# Altium schematic sheet Sheet1.SchDoc
size A3
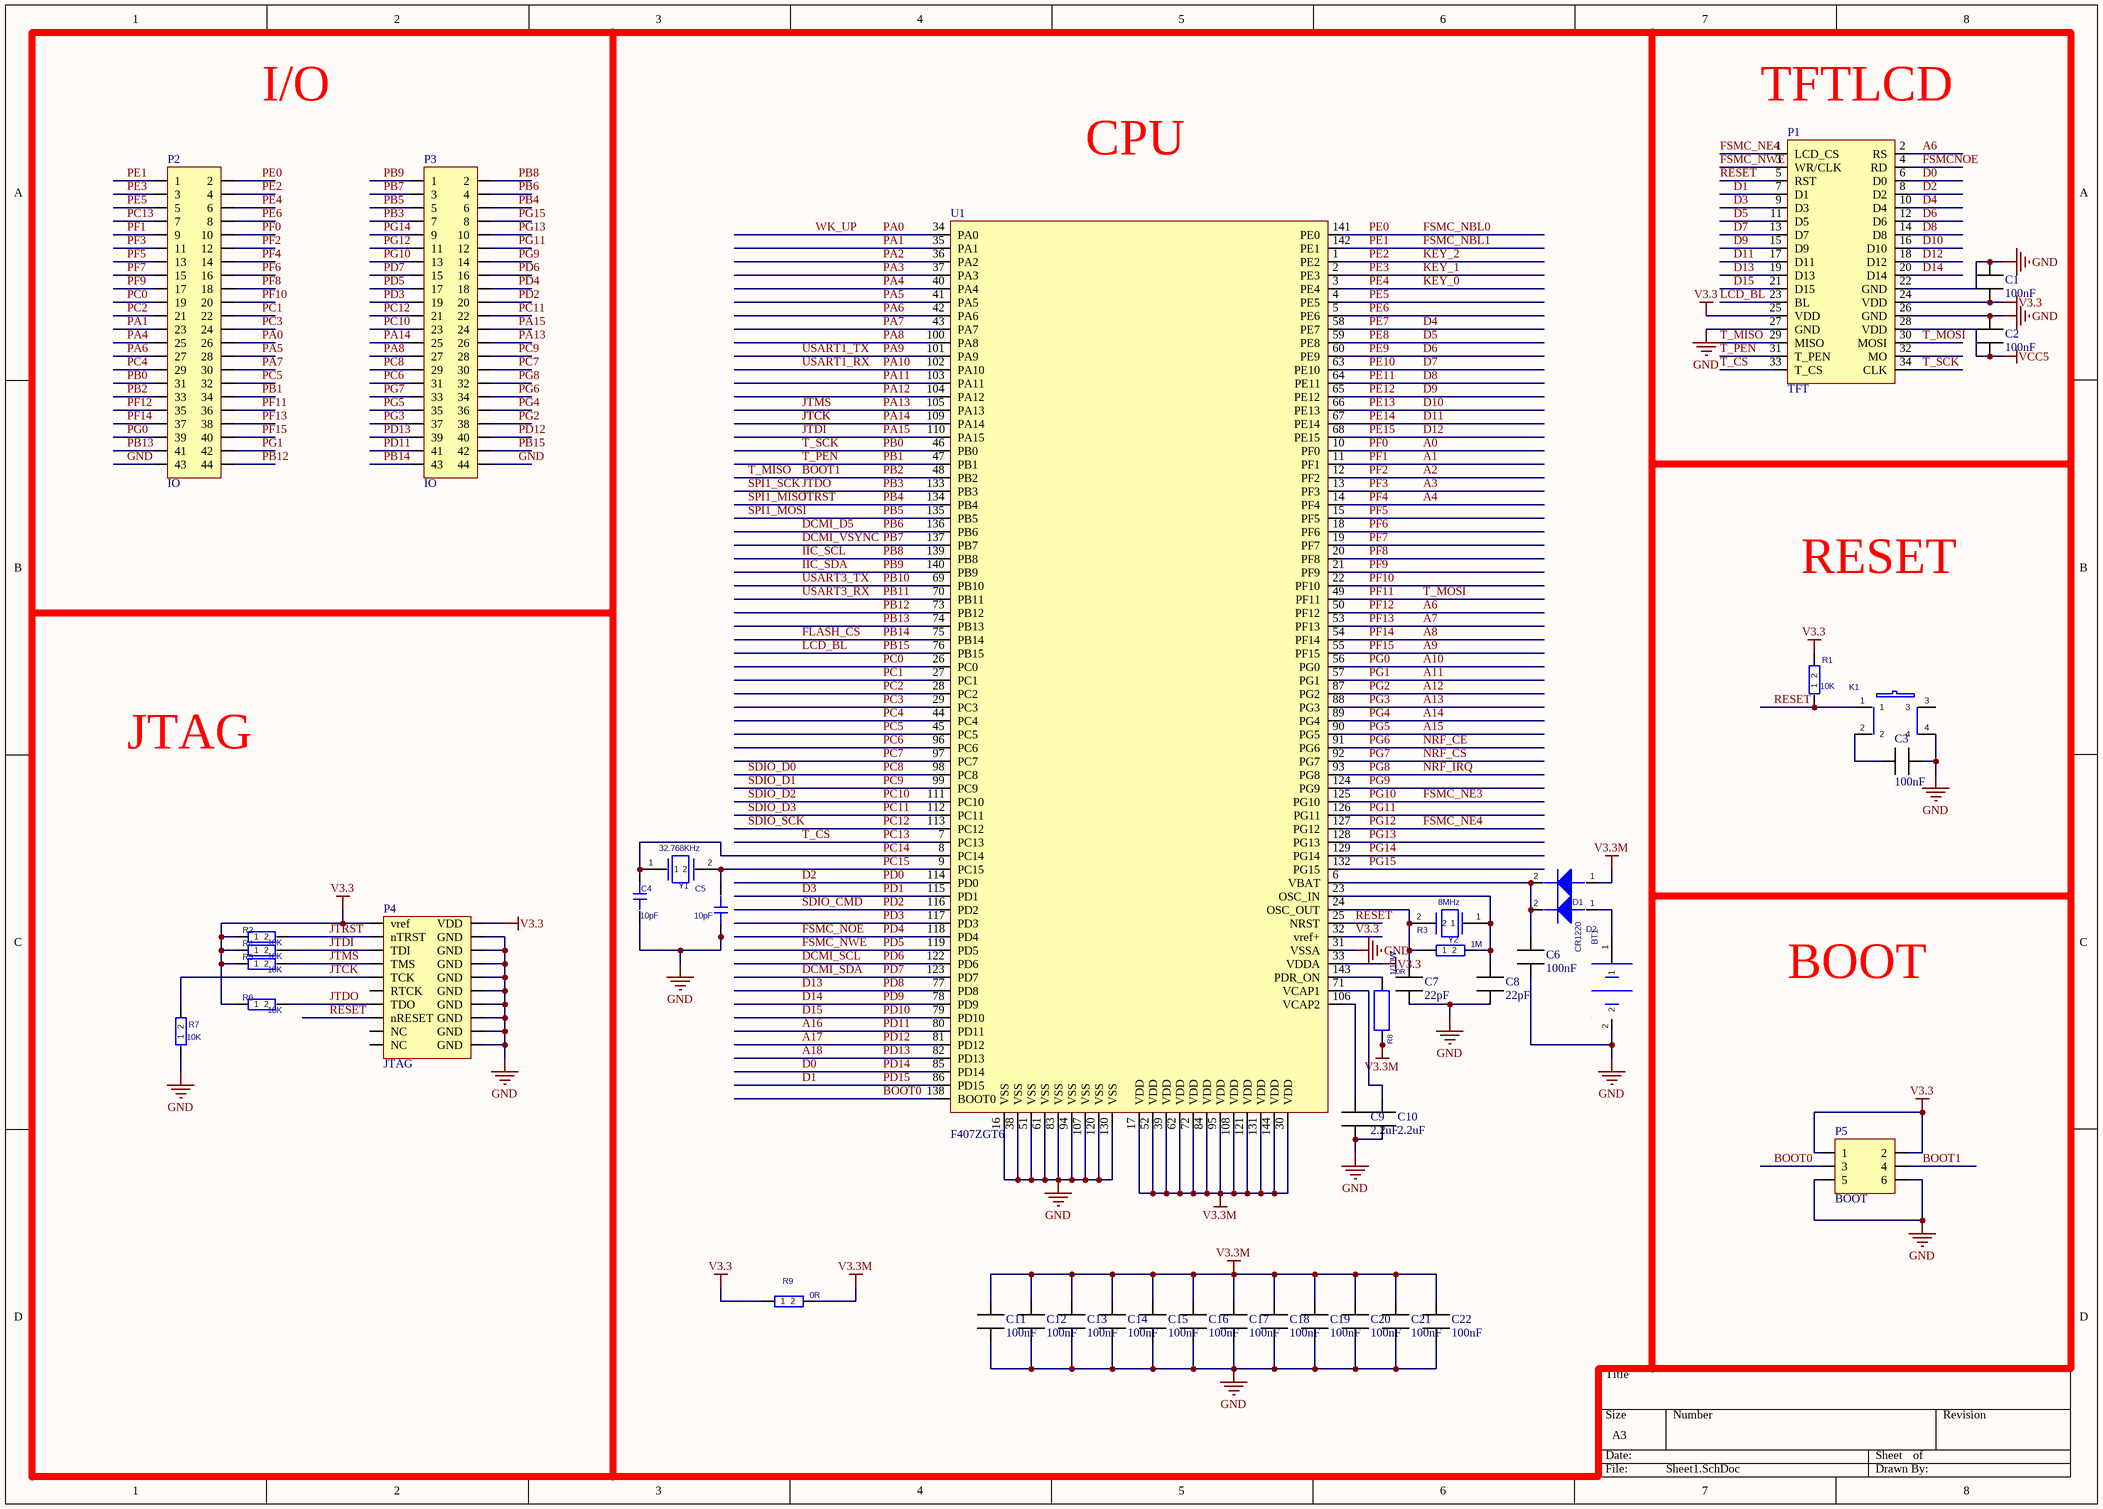
[diagram p0: Sheet1.SchDoc]

## Parts
BT1  CR1220  [BATERY]
C1  100nF  [CAP_0603_FIRE]
C2  100nF  [CAP_0603_FIRE]
C3  100nF  [CAP_0603_FIRE]
C4  value 10pF  [CAP_0603_FIRE]  (hidden comment: CAP_0.1UF_0603_FIRE)
C5  value 10pF  [CAP_0603_FIRE]  (hidden comment: CAP_0.1UF_0603_FIRE)
C6  100nF  [CAP_0603_FIRE]
C7  22pF  [CAP_0603_FIRE]
C8  22pF  [CAP_0603_FIRE]
C9  2.2uF  [CAP_0603_FIRE]
C10  2.2uF  [CAP_0603_FIRE]
C11  100nF  [CAP_0603_FIRE]
C12  100nF  [CAP_0603_FIRE]
C13  100nF  [CAP_0603_FIRE]
C14  100nF  [CAP_0603_FIRE]
C15  100nF  [CAP_0603_FIRE]
C16  100nF  [CAP_0603_FIRE]
C17  100nF  [CAP_0603_FIRE]
C18  100nF  [CAP_0603_FIRE]
C19  100nF  [CAP_0603_FIRE]
C20  100nF  [CAP_0603_FIRE]
C21  100nF  [CAP_0603_FIRE]
C22  100nF  [CAP_0603_FIRE]
D1  IN4148  [DIODE_SOP]  (value not drawn)
D2  IN4148  [DIODE_SOP]  (value not drawn)
K1  KEY  [SW6.2/6.2-SMD]  (value not drawn)
P1  TFT  [TFT]
P2  IO  [HEAD2*22]
P3  IO  [HEAD2*22]
P4  JTAG  [FC20H]
P5  BOOT  [BOOT]
R1  value 10K  [RES_0603_FIRE]  (hidden comment: RES_1K_0603_FIRE)
R2  value 10K  [RES_0603_FIRE]  (hidden comment: RES_10K_0603_FIRE)
R3  value 1M  [RES_0603_FIRE]  (hidden comment: RES_1K_0603_FIRE)
R4  value 10K  [RES_0603_FIRE]  (hidden comment: RES_10K_0603_FIRE)
R5  value 10K  [RES_0603_FIRE]  (hidden comment: RES_10K_0603_FIRE)
R6  value 10K  [RES_0603_FIRE]  (hidden comment: RES_10K_0603_FIRE)
R7  value 10K  [RES_0603_FIRE]  (hidden comment: RES_10K_0603_FIRE)
R8  value 0R  Power: 1/10W  [0603]  (hidden comment: RES-0603-0R)
R9  value 0R  [RES_0603_FIRE]  (hidden comment: RES_1K_0603_FIRE)
U1  F407ZGT6  [STM32F407ZGT6]
Y1  value 32.768KHz  [CRYS-3X8]  (hidden comment: XTAL_32.768KHZ_FIRE)
Y2  value 8MHz  [CRYSTAL_SMD_FIRE]  (hidden comment: XTAL_8M_FIRE)

## Nets
GND: BT1.2 C1.2 C2.2 C3.1 C4.1 C5.1 C6.1 C7.1 C8.1 C9.1 C10.1 C11.1 C12.1 C13.1 C14.1 C15.1 C16.1 C17.1 C18.1 C19.1 C20.1 C21.1 C22.1 K1.4 P1.22(GND) P1.26(GND) P1.27(GND) P2.43 P3.44 P4.4(GND) P4.6(GND) P4.8(GND) P4.10(GND) P4.12(GND) P4.14(GND) P4.16(GND) P4.18(GND) P4.20(GND) P5.5 P5.6 R7.1 U1.16(VSS) U1.31(VSSA) U1.38(VSS) U1.51(VSS) U1.61(VSS) U1.83(VSS) U1.94(VSS) U1.107(VSS) U1.120(VSS) U1.130(VSS)
V3.3: C1.1 P1.24(VDD) P1.25(VDD) P4.1(vref) P4.2(VDD) P5.1 P5.2 R1.2 R2.1 R4.1 R5.1 R6.1 R9.1 U1.32(vref+) U1.33(VDDA)
V3.3M: C11.2 C12.2 C13.2 C14.2 C15.2 C16.2 C17.2 C18.2 C19.2 C20.2 C21.2 C22.2 D1.1(+) R8.1 R9.2 U1.17(VDD) U1.30(VDD) U1.39(VDD) U1.52(VDD) U1.62(VDD) U1.72(VDD) U1.84(VDD) U1.95(VDD) U1.108(VDD) U1.121(VDD) U1.131(VDD) U1.144(VDD)
VCC5: C2.1 P1.28(VDD)
A0: P2.10 U1.10(PF0)  [also labelled PF0]
A1: P2.9 U1.11(PF1)  [also labelled PF1]
A2: P2.12 U1.12(PF2)  [also labelled PF2]
A3: P2.11 U1.13(PF3)  [also labelled PF3]
A4: P2.14 U1.14(PF4)  [also labelled PF4]
A6: P1.2(RS) P2.35 U1.50(PF12)  [also labelled PF12]
A7: P2.38 U1.53(PF13)  [also labelled PF13]
A8: P2.37 U1.54(PF14)  [also labelled PF14]
A9: P2.40 U1.55(PF15)  [also labelled PF15]
A10: P2.39 U1.56(PG0)  [also labelled PG0]
A11: P2.42 U1.57(PG1)  [also labelled PG1]
A12: P3.38 U1.87(PG2)  [also labelled PG2]
A13: P3.37 U1.88(PG3)  [also labelled PG3]
A14: P3.36 U1.89(PG4)  [also labelled PG4]
A15: P3.35 U1.90(PG5)  [also labelled PG5]
A16: P3.41 U1.80(PD11)  [also labelled PD11]
A17: P3.40 U1.81(PD12)  [also labelled PD12]
A18: P3.39 U1.82(PD13)  [also labelled PD13]
BOOT0: P5.3 U1.138(BOOT0)
BOOT1: P1.29(MISO) P2.33 P5.4 U1.48(PB2)  [also labelled PB2, T_MISO]
D0: P1.6(D0) U1.85(PD14)  [also labelled PD14]
D1: P1.7(D1) U1.86(PD15)  [also labelled PD15]
D2: P1.8(D2) U1.114(PD0)  [also labelled PD0]
D3: P1.9(D3) U1.115(PD1)  [also labelled PD1]
D4: P1.10(D4) U1.58(PE7)  [also labelled PE7]
D5: P1.11(D5) U1.59(PE8)  [also labelled PE8]
D6: P1.12(D6) U1.60(PE9)  [also labelled PE9]
D7: P1.13(D7) U1.63(PE10)  [also labelled PE10]
D8: P1.14(D8) U1.64(PE11)  [also labelled PE11]
D9: P1.15(D9) U1.65(PE12)  [also labelled PE12]
D10: P1.16(D10) U1.66(PE13)  [also labelled PE13]
D11: P1.17(D11) U1.67(PE14)  [also labelled PE14]
D12: P1.18(D12) U1.68(PE15)  [also labelled PE15]
D13: P1.19(D13) U1.77(PD8)  [also labelled PD8]
D14: P1.20(D14) U1.78(PD9)  [also labelled PD9]
D15: P1.21(D15) U1.79(PD10)  [also labelled PD10]
DCMI_D5: P3.4 U1.136(PB6)  [also labelled PB6]
DCMI_SCL: P3.16 U1.122(PD6)  [also labelled PD6]
DCMI_SDA: P3.15 U1.123(PD7)  [also labelled PD7]
DCMI_VSYNC: P3.3 U1.137(PB7)  [also labelled PB7]
FLASH_CS: P3.43 U1.75(PB14)  [also labelled PB14]
FSMC_NBL0: P2.2 U1.141(PE0)  [also labelled PE0]
FSMC_NBL1: P2.1 U1.142(PE1)  [also labelled PE1]
FSMC_NE3: P3.13 U1.125(PG10)  [also labelled PG10]
FSMC_NE4: P1.1(LCD_CS) P3.11 U1.127(PG12)  [also labelled PG12]
FSMC_NOE: P3.18 U1.118(PD4)  [also labelled PD4]
FSMC_NWE: P1.3(WR/CLK) P3.17 U1.119(PD5)  [also labelled PD5]
FSMCNOE: P1.4(RD)
IIC_SCL: P3.2 U1.139(PB8)  [also labelled PB8]
IIC_SDA: P3.1 U1.140(PB9)  [also labelled PB9]
JTCK: P3.25 P4.9(TCK) R7.2 U1.109(PA14)  [also labelled PA14]
JTDI: P3.24 P4.5(TDI) R4.2 U1.110(PA15)  [also labelled PA15]
JTDO: P3.7 P4.13(TDO) R6.2 U1.133(PB3)  [also labelled PB3, SPI1_SCK]
JTMS: P3.26 P4.7(TMS) R5.2 U1.105(PA13)  [also labelled PA13]
JTRST: P3.6 P4.3(nTRST) R2.2 U1.134(PB4)  [also labelled PB4, SPI1_MISO]
KEY_0: P2.6 U1.3(PE4)  [also labelled PE4]
KEY_1: P2.3 U1.2(PE3)  [also labelled PE3]
KEY_2: P2.4 U1.1(PE2)  [also labelled PE2]
LCD_BL: P1.23(BL) P3.42 U1.76(PB15)  [also labelled PB15]
NRF_CE: P3.34 U1.91(PG6)  [also labelled PG6]
NRF_CS: P3.33 U1.92(PG7)  [also labelled PG7]
NRF_IRQ: P3.32 U1.93(PG8)  [also labelled PG8]
PA0: P2.26 U1.34(PA0)  [also labelled WK_UP]
PA1: P2.23 U1.35(PA1)
PA2: U1.36(PA2)
PA3: U1.37(PA3)
PA4: P2.25 U1.40(PA4)
PA5: P2.28 U1.41(PA5)
PA6: P2.27 U1.42(PA6)
PA7: P2.30 U1.43(PA7)
PA8: P3.27 U1.100(PA8)
PA9: U1.101(PA9)  [also labelled USART1_TX]
PA10: U1.102(PA10)  [also labelled USART1_RX]
PA11: U1.103(PA11)
PA12: U1.104(PA12)
PB0: P1.34(CLK) P2.31 U1.46(PB0)  [also labelled T_SCK]
PB1: P1.31(T_PEN) P2.34 U1.47(PB1)  [also labelled T_PEN]
PB5: P3.5 U1.135(PB5)  [also labelled SPI1_MOSI]
PB10: U1.69(PB10)  [also labelled USART3_TX]
PB11: U1.70(PB11)  [also labelled USART3_RX]
PB12: P2.44 U1.73(PB12)
PB13: P2.41 U1.74(PB13)
PC0: P2.19 U1.26(PC0)
PC1: P2.22 U1.27(PC1)
PC2: P2.21 U1.28(PC2)
PC3: P2.24 U1.29(PC3)
PC4: P2.29 U1.44(PC4)
PC5: P2.32 U1.45(PC5)
PC6: P3.31 U1.96(PC6)
PC7: P3.30 U1.97(PC7)
PC8: P3.29 U1.98(PC8)  [also labelled SDIO_D0]
PC9: P3.28 U1.99(PC9)  [also labelled SDIO_D1]
PC10: P3.23 U1.111(PC10)  [also labelled SDIO_D2]
PC11: P3.22 U1.112(PC11)  [also labelled SDIO_D3]
PC12: P3.21 U1.113(PC12)  [also labelled SDIO_SCK]
PC13: P1.33(T_CS) P2.7 U1.7(PC13)  [also labelled T_CS]
PC14: C4.2 U1.8(PC14) Y1.1
PC15: C5.2 U1.9(PC15) Y1.2
PD2: P3.20 U1.116(PD2)  [also labelled SDIO_CMD]
PD3: P3.19 U1.117(PD3)
PE5: P2.5 U1.4(PE5)
PE6: P2.8 U1.5(PE6)
PF5: P2.13 U1.15(PF5)
PF6: P2.16 U1.18(PF6)
PF7: P2.15 U1.19(PF7)
PF8: P2.18 U1.20(PF8)
PF9: P2.17 U1.21(PF9)
PF10: P2.20 U1.22(PF10)
PF11: P1.30(MOSI) P2.36 U1.49(PF11)  [also labelled T_MOSI]
PG9: P3.14 U1.124(PG9)
PG11: P3.12 U1.126(PG11)
PG13: P3.10 U1.128(PG13)
PG14: P3.9 U1.129(PG14)
PG15: P3.8 U1.132(PG15)
RESET: K1.1 P1.5(RST) P4.15(nRESET) R1.1 U1.25(NRST)
NetBT1_1: BT1.1 D2.1(+)
NetC3_2: C3.2 K1.2
NetC6_2: C6.2 D1.2(-) D2.2(-) U1.6(VBAT)
NetC7_2: C7.2 R3.1 U1.24(OSC_OUT) Y2.2
NetC8_2: C8.2 R3.2 U1.23(OSC_IN) Y2.1
NetC9_2: C9.2 U1.106(VCAP2)
NetC10_2: C10.2 U1.71(VCAP1)
NetR8_2: R8.2 U1.143(PDR_ON)

Not connected (* = marked no-connect by the designer): K1 3; P1 32(MO); P4 11(RTCK) 17(NC) 19(NC)

## Notes on the sheet
- I/O
- (near P1) TFTLCD
- CPU
- RESET
- JTAG
- BOOT

## Library data of the parts
C1-C3 C6-C22 = CAP
C4 C5 = CAP_0.1UF_0603_FIRE: SURFACE MOUNT CAPACITOR 0.031 X 0.061 INCHES; PCB DECAL: CAP_0603_FIRE
R1 R3 R9 = RES_1K_0603_FIRE: 0402; Manufacture 1: SUPEROHM; Tolerance: +-5%; Assembly: SMD; PCB DECAL: RES_0603_FIRE
R2 R4-R7 = RES_10K_0603_FIRE: SURFACE MOUNT RESISTOR 0.031 X 0.061 INCHES, 1/10W; Assembly: SMD; PCB DECAL: RES_0603_FIRE
R8 = RES-0603-0R: 0603, 50V, 1/10W, 5%; Partname: 贴片电阻 0603; Part_Number: RE200045-01; Mfr_Part_Number: RS03K104JT; Mfr: Fenghua; Spec: 0R,1/10W,5%,RS03K104JT(风华); Remarks: Checked; Gtech_Number: 50106031003JR1001; Source_Path: D:\CADENCELIB\CAPTURELIB\LC_PASSIVE.OLB; PCB DECAL: 0603; Availability: 0
Y1 = XTAL_32.768KHZ_FIRE: CRYSTAL; PCB DECAL: CRYS-3X8
Y2 = XTAL_8M_FIRE: CRYSTAL; PCB DECAL: CRYSTAL_SMD_FIRE
BT1 = CR1220: PCB DECAL: BATERY
D1 D2 = IN4148: PCB DECAL: DIODE_SOP
K1 = KEY: Manufacturer #1 PN: KEY; PCB DECAL: SW6.2/6.2-SMD